# EAGLE schematic isolator (EAGLE 6.5.0)

## Sheet 1 of 2
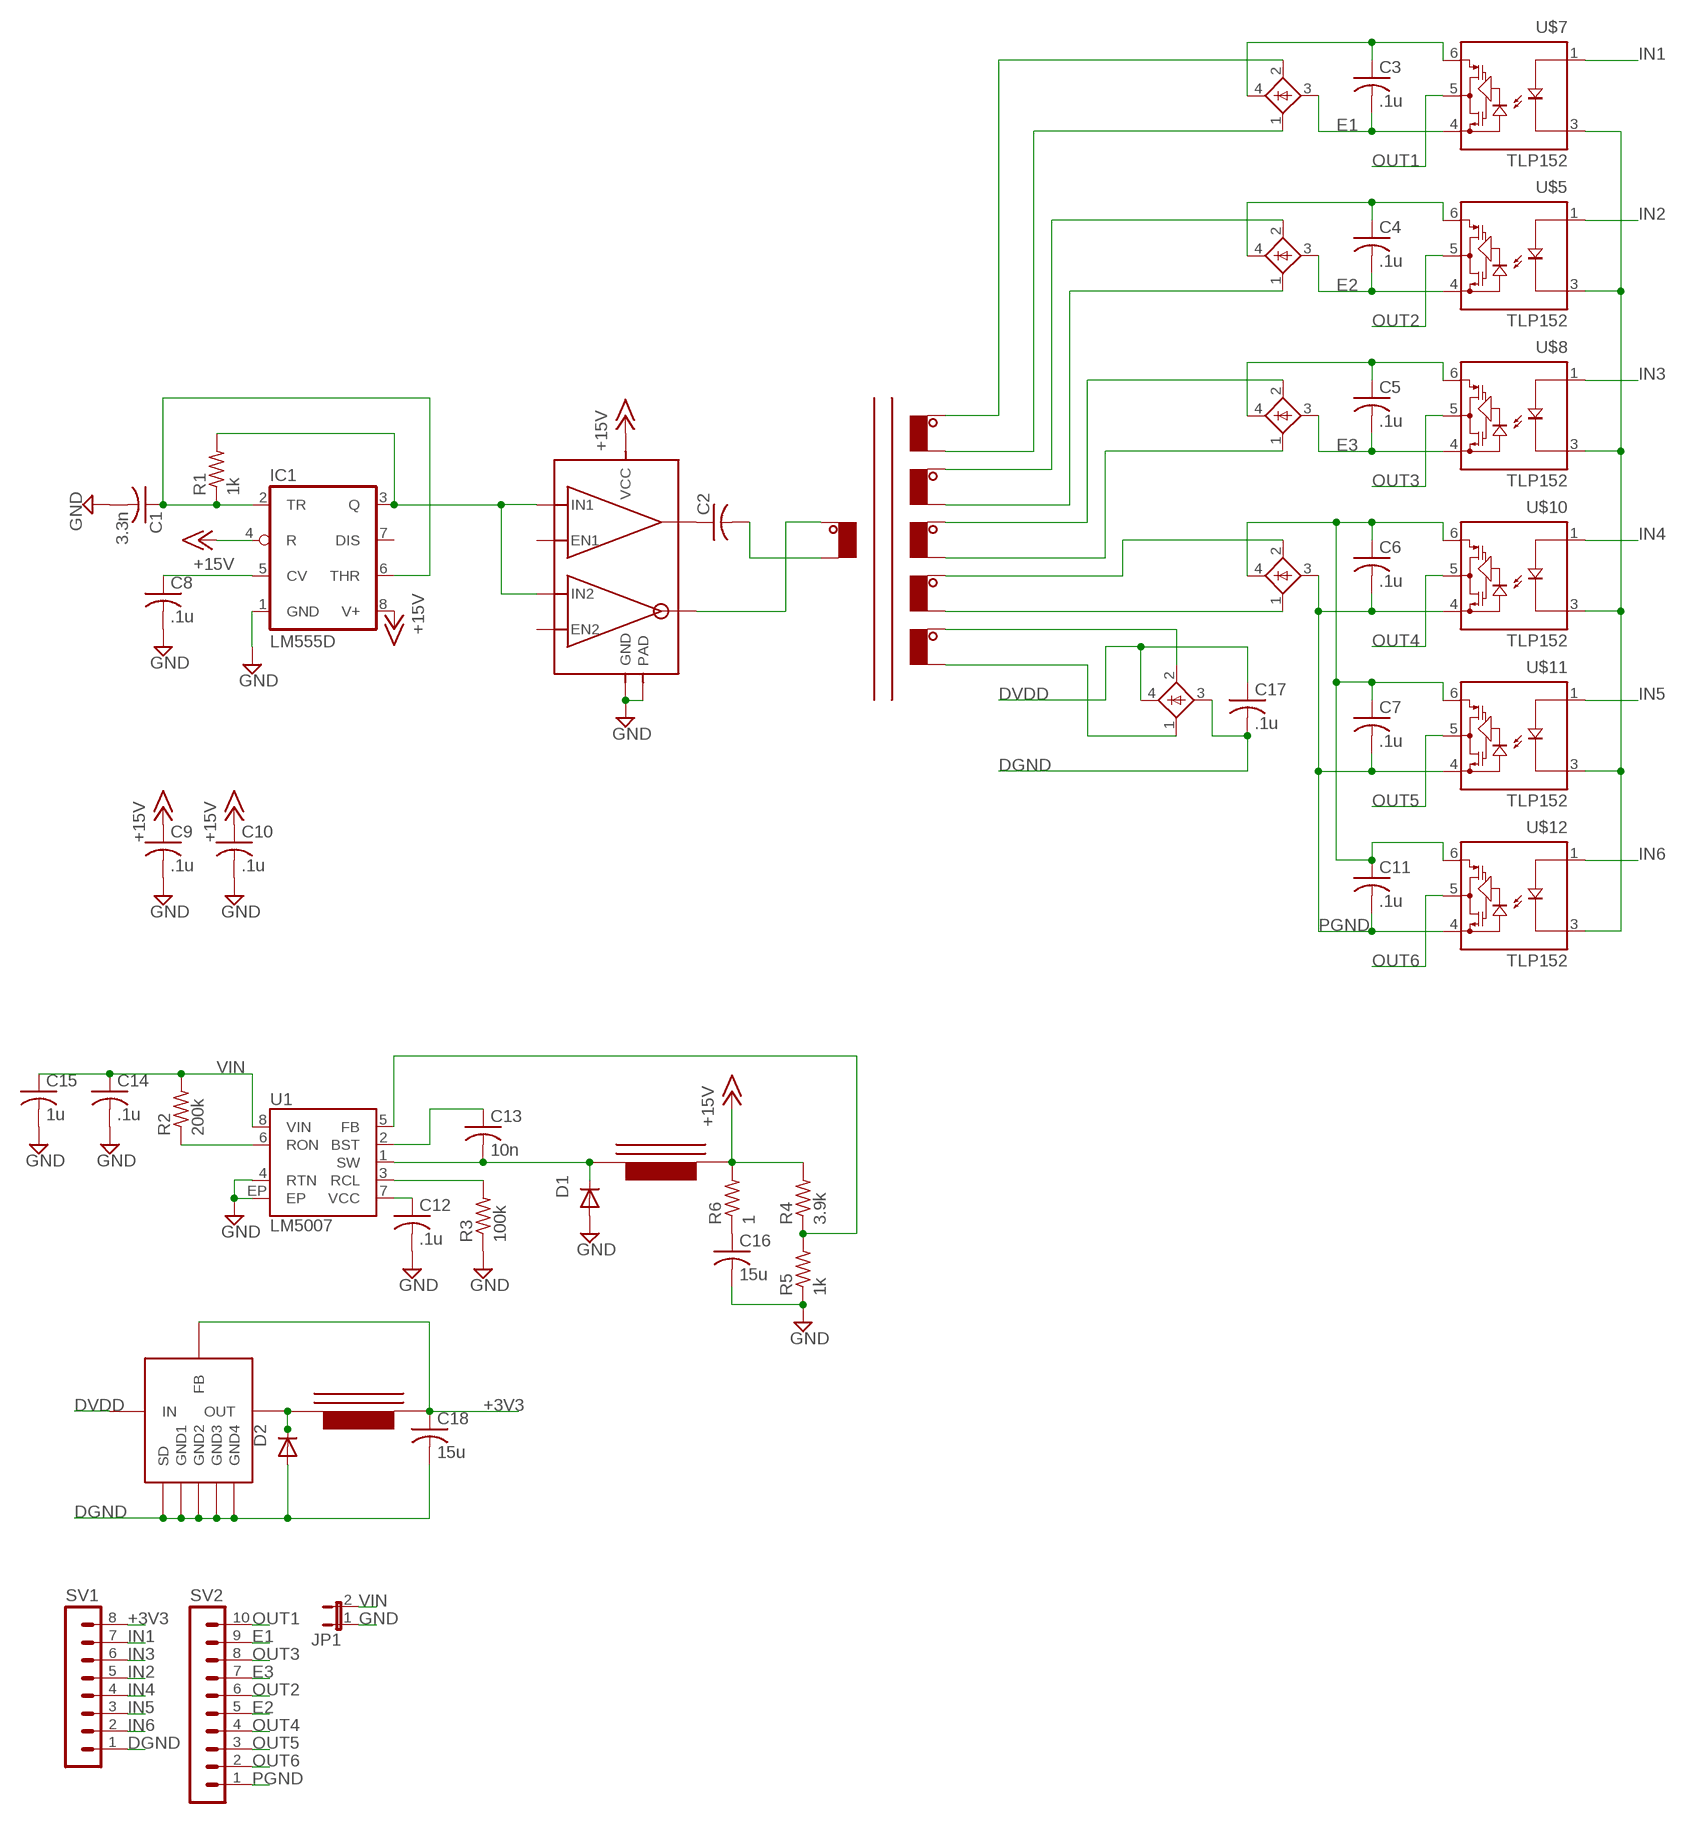
[diagram p0: schematic, sheet 1]

### Parts
C1  3.3n  C-USC0805K  [C0805K]
C2  C-USC0805K  [C0805K]
C3  .1u  C-USC0805K  [C0805K]
C4  .1u  C-USC0805K  [C0805K]
C5  .1u  C-USC0805K  [C0805K]
C6  .1u  C-USC0805K  [C0805K]
C7  .1u  C-USC0805K  [C0805K]
C8  .1u  C-USC0805K  [C0805K]
C9  .1u  C-USC0805K  [C0805K]
C10  .1u  C-USC0805K  [C0805K]
C11  .1u  C-USC0805K  [C0805K]
C12  .1u  C-USC0805K  [C0805K]
C13  10n  C-USC0805K  [C0805K]
C14  .1u  C-USC0805K  [C0805K]
C15  1u  C-USC0805K  [C0805K]
C16  15u  C-USC0805K  [C0805K]
C17  .1u  C-USC0805K  [C0805K]
C18  15u  C-USC0805K  [C0805K]
D1  B170-13-F  DIODE-DO214AC  [DO214AC]
D2  B170-13-F  DIODE-DO214AC  [DO214AC]
IC1  LM555D  [SO08]
JP1  JP1E  [JP1]
R1  1k  R-US_M0805  [M0805]
R2  200k  R-US_M0805  [M0805]
R3  100k  R-US_M0805  [M0805]
R4  3.9k  R-US_M0805  [M0805]
R5  1k  R-US_M0805  [M0805]
R6  1  R-US_M0805  [M0805]
SV1  MA08-1  [MA08-1]
SV2  MA10-1  [MA10-1]
U1  LM5007  [MSOP-8-EP]
U$1  HP1  [HP1]
U$2  UCC27525DGN  [HTSSOP8DGN]
U$3  BAS4002A  [SOT-143]
U$4  BAS4002A  [SOT-143]
U$5  TLP152  [DIP5-SMD]
U$6  BAS4002A  [SOT-143]
U$7  TLP152  [DIP5-SMD]
U$8  TLP152  [DIP5-SMD]
U$9  BAS4002A  [SOT-143]
U$10  TLP152  [DIP5-SMD]
U$11  TLP152  [DIP5-SMD]
U$12  TLP152  [DIP5-SMD]
U$13  SRN6045-101M  [SRN6045]
U$14  BAS4002A  [SOT-143]
U$15  AP1509  [SO8]
U$16  SRN6045-101M  [SRN6045]

### Nets
+3V3: C18.1 SV1.8 U$15.3(FB) U$16.P$2 ; also sheet 2
+15V: C9.1 C10.1 IC1.4(R) IC1.8(V+) R4.2 R6.2 U$2.6(VCC) U$13.P$2
DGND: C17.2 C18.2 D2.A SV1.1 U$5.3(LED-) U$7.3(LED-) U$8.3(LED-) U$10.3(LED-) U$11.3(LED-) U$12.3(LED-) U$14.3(-) U$15.4(SD) U$15.5(GND1) U$15.6(GND2) U$15.7(GND3) U$15.8(GND4)
DVDD: C17.1 U$14.4(+) U$15.1(IN)
E1: C3.2 SV2.9 U$3.3(-) U$7.4(GND)
E2: C4.2 SV2.5 U$4.3(-) U$5.4(GND)
E3: C5.2 SV2.7 U$6.3(-) U$8.4(GND)
GND: C1.2 C8.2 C9.2 C10.2 C12.2 C14.2 C15.2 C16.2 D1.A IC1.1(GND) JP1.1 R3.1 R5.1 U1.4(RTN) U1.EP U$2.3(GND) U$2.EXP(PAD) ; also sheet 2
IN1: SV1.7 U$7.1(LED+)
IN2: SV1.5 U$5.1(LED+)
IN3: SV1.6 U$8.1(LED+)
IN4: SV1.4 U$10.1(LED+)
IN5: SV1.3 U$11.1(LED+)
IN6: SV1.2 U$12.1(LED+)
N$1: U$1.P$3(3B) U$3.1(AC1)
N$2: C3.1 U$3.4(+) U$7.6(VDD)
N$4: C2.1 U$2.7(OUT1)
N$5: U$1.P$4(1A) U$2.5(OUT2)
N$6: C1.1 IC1.2(TR) IC1.6(THR) R1.1
N$7: U$1.P$10(4A) U$4.2(AC2)
N$8: C8.1 IC1.5(CV)
N$10: IC1.3(Q) R1.2 U$2.2(IN1) U$2.4(IN2)
N$11: U$1.P$6(3A) U$3.2(AC2)
N$12: U$1.P$7(4B) U$4.1(AC1)
N$13: C4.1 U$4.4(+) U$5.6(VDD)
N$15: U$1.P$11(5A) U$6.2(AC2)
N$16: U$1.P$8(5B) U$6.1(AC1)
N$17: C5.1 U$6.4(+) U$8.6(VDD)
N$19: U$1.P$12(6A) U$9.2(AC2)
N$20: U$1.P$9(6B) U$9.1(AC1)
N$23: C16.1 R6.1
N$24: U$1.P$5(2A) U$14.2(AC2)
N$25: C6.1 C7.1 C11.1 U$9.4(+) U$10.6(VDD) U$11.6(VDD) U$12.6(VDD)
N$26: R4.1 R5.2 U1.5(FB)
N$27: U$1.P$2(2B) U$14.1(AC1)
N$28: R2.1 U1.6(RON)
N$29: D2.C U$15.2(OUT) U$16.P$1
N$30: C2.2 U$1.P$1(1B)
N$31: C12.1 U1.7(VCC)
N$32: C13.2 D1.C U1.1(SW) U$13.P$1
N$33: C13.1 U1.2(BST)
N$34: R3.2 U1.3(RCL)
OUT1: SV2.10 U$7.5(VO)
OUT2: SV2.6 U$5.5(VO)
OUT3: SV2.8 U$8.5(VO)
OUT4: SV2.4 U$10.5(VO)
OUT5: SV2.3 U$11.5(VO)
OUT6: SV2.2 U$12.5(VO)
PGND: C6.2 C7.2 C11.2 SV2.1 U$9.3(-) U$10.4(GND) U$11.4(GND) U$12.4(GND)
VIN: C14.1 C15.1 JP1.2 R2.2 U1.8(VIN)
Unconnected: IC1.7(DIS) U$2.1(EN1) U$2.8(EN2)

## Sheet 2 of 2
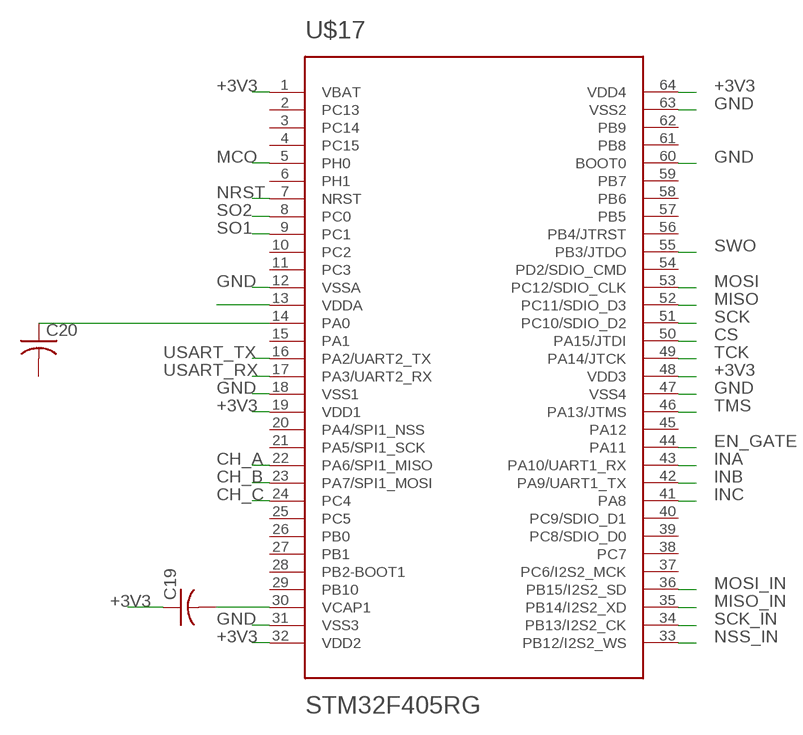
[diagram p1: schematic, sheet 2]

### Parts
C19  C-USC0805K  [C0805K]
C20  C-USC0805K  [C0805K]
U$17  STM32F405RG  [TQFP64]

### Nets
+3V3: C19.1 U$17.1(VBAT) U$17.19(VDD1) U$17.32(VDD2) U$17.48(VDD3) U$17.64(VDD4) ; also sheet 1
CH_A: U$17.22(PA6/SPI1_MISO)
CH_B: U$17.23(PA7/SPI1_MOSI)
CH_C: U$17.24(PC4)
CS: U$17.50(PA15/JTDI)
EN_GATE: U$17.44(PA11)
GND: U$17.12(VSSA) U$17.18(VSS1) U$17.31(VSS3) U$17.47(VSS4) U$17.60(BOOT0) U$17.63(VSS2) ; also sheet 1
INA: U$17.43(PA10/UART1_RX)
INB: U$17.42(PA9/UART1_TX)
INC: U$17.41(PA8)
MCO: U$17.5(PH0)
MISO: U$17.52(PC11/SDIO_D3)
MISO_IN: U$17.35(PB14/I2S2_XD)
MOSI: U$17.53(PC12/SDIO_CLK)
MOSI_IN: U$17.36(PB15/I2S2_SD)
N$35: U$17.13(VDDA)
N$36: C20.1 U$17.14(PA0)
N$44: C19.2 U$17.30(VCAP1)
NRST: U$17.7(NRST)
NSS_IN: U$17.33(PB12/I2S2_WS)
SCK: U$17.51(PC10/SDIO_D2)
SCK_IN: U$17.34(PB13/I2S2_CK)
SO1: U$17.9(PC1)
SO2: U$17.8(PC0)
SWO: U$17.55(PB3/JTDO)
TCK: U$17.49(PA14/JTCK)
TMS: U$17.46(PA13/JTMS)
USART_RX: U$17.17(PA3/UART2_RX)
USART_TX: U$17.16(PA2/UART2_TX)
Unconnected: C20.2 U$17.2(PC13) U$17.3(PC14) U$17.4(PC15) U$17.6(PH1) U$17.10(PC2) U$17.11(PC3) U$17.15(PA1) U$17.20(PA4/SPI1_NSS) U$17.21(PA5/SPI1_SCK) U$17.25(PC5) U$17.26(PB0) U$17.27(PB1) U$17.28(PB2-BOOT1) U$17.29(PB10) U$17.37(PC6/I2S2_MCK) U$17.38(PC7) U$17.39(PC8/SDIO_D0) U$17.40(PC9/SDIO_D1) U$17.45(PA12) U$17.54(PD2/SDIO_CMD) U$17.56(PB4/JTRST) U$17.57(PB5) U$17.58(PB6) U$17.59(PB7) U$17.61(PB8) U$17.62(PB9)

## Library data of the parts
C1-C18 = rcl:C-US: CAPACITOR, American symbol
C19 C20 = cheetah_driver_2:C-US: CAPACITOR, American symbol
D1 D2 = diode:DIODE-: DIODE
IC1 = linear:*555: TIMER
JP1 = jumper:JP1E: JUMPER
R1-R6 = resistor:R-US_: RESISTOR, American symbol
SV1 = con-lstb:MA08-1: PIN HEADER; OC_FARNELL: unknown; OC_NEWARK: unknown
SV2 = con-lstb:MA10-1: PIN HEADER; OC_FARNELL: unknown; OC_NEWARK: unknown
U1 = SparkFun-PowerIC:LM5007: High Voltage (80V) Step-down switching regulator http://www.national.com/ds/LM/LM5007.pdf
U$1 = brushlessrage:HP1
U$2 = brushlessrage:UCC27525DGN
U$3 U$4 U$6 U$9 U$14 = utesla:BAS4002A
U$5 U$7 U$8 U$10-U$12 = brushlessrage:TLP152
U$13 U$16 = brushlessrage:SRN6045-101M
U$15 = brushlessrage:AP1509
U$17 = cheetah_driver_2:STM32F405RG: ARM DSP Chip used on the WAV Trigger board.